# Altium schematic sheet MX8M-Nano-Boot.SchDoc
size 431 x 330 mm; SheetNumber: 6; SheetTotal: 16
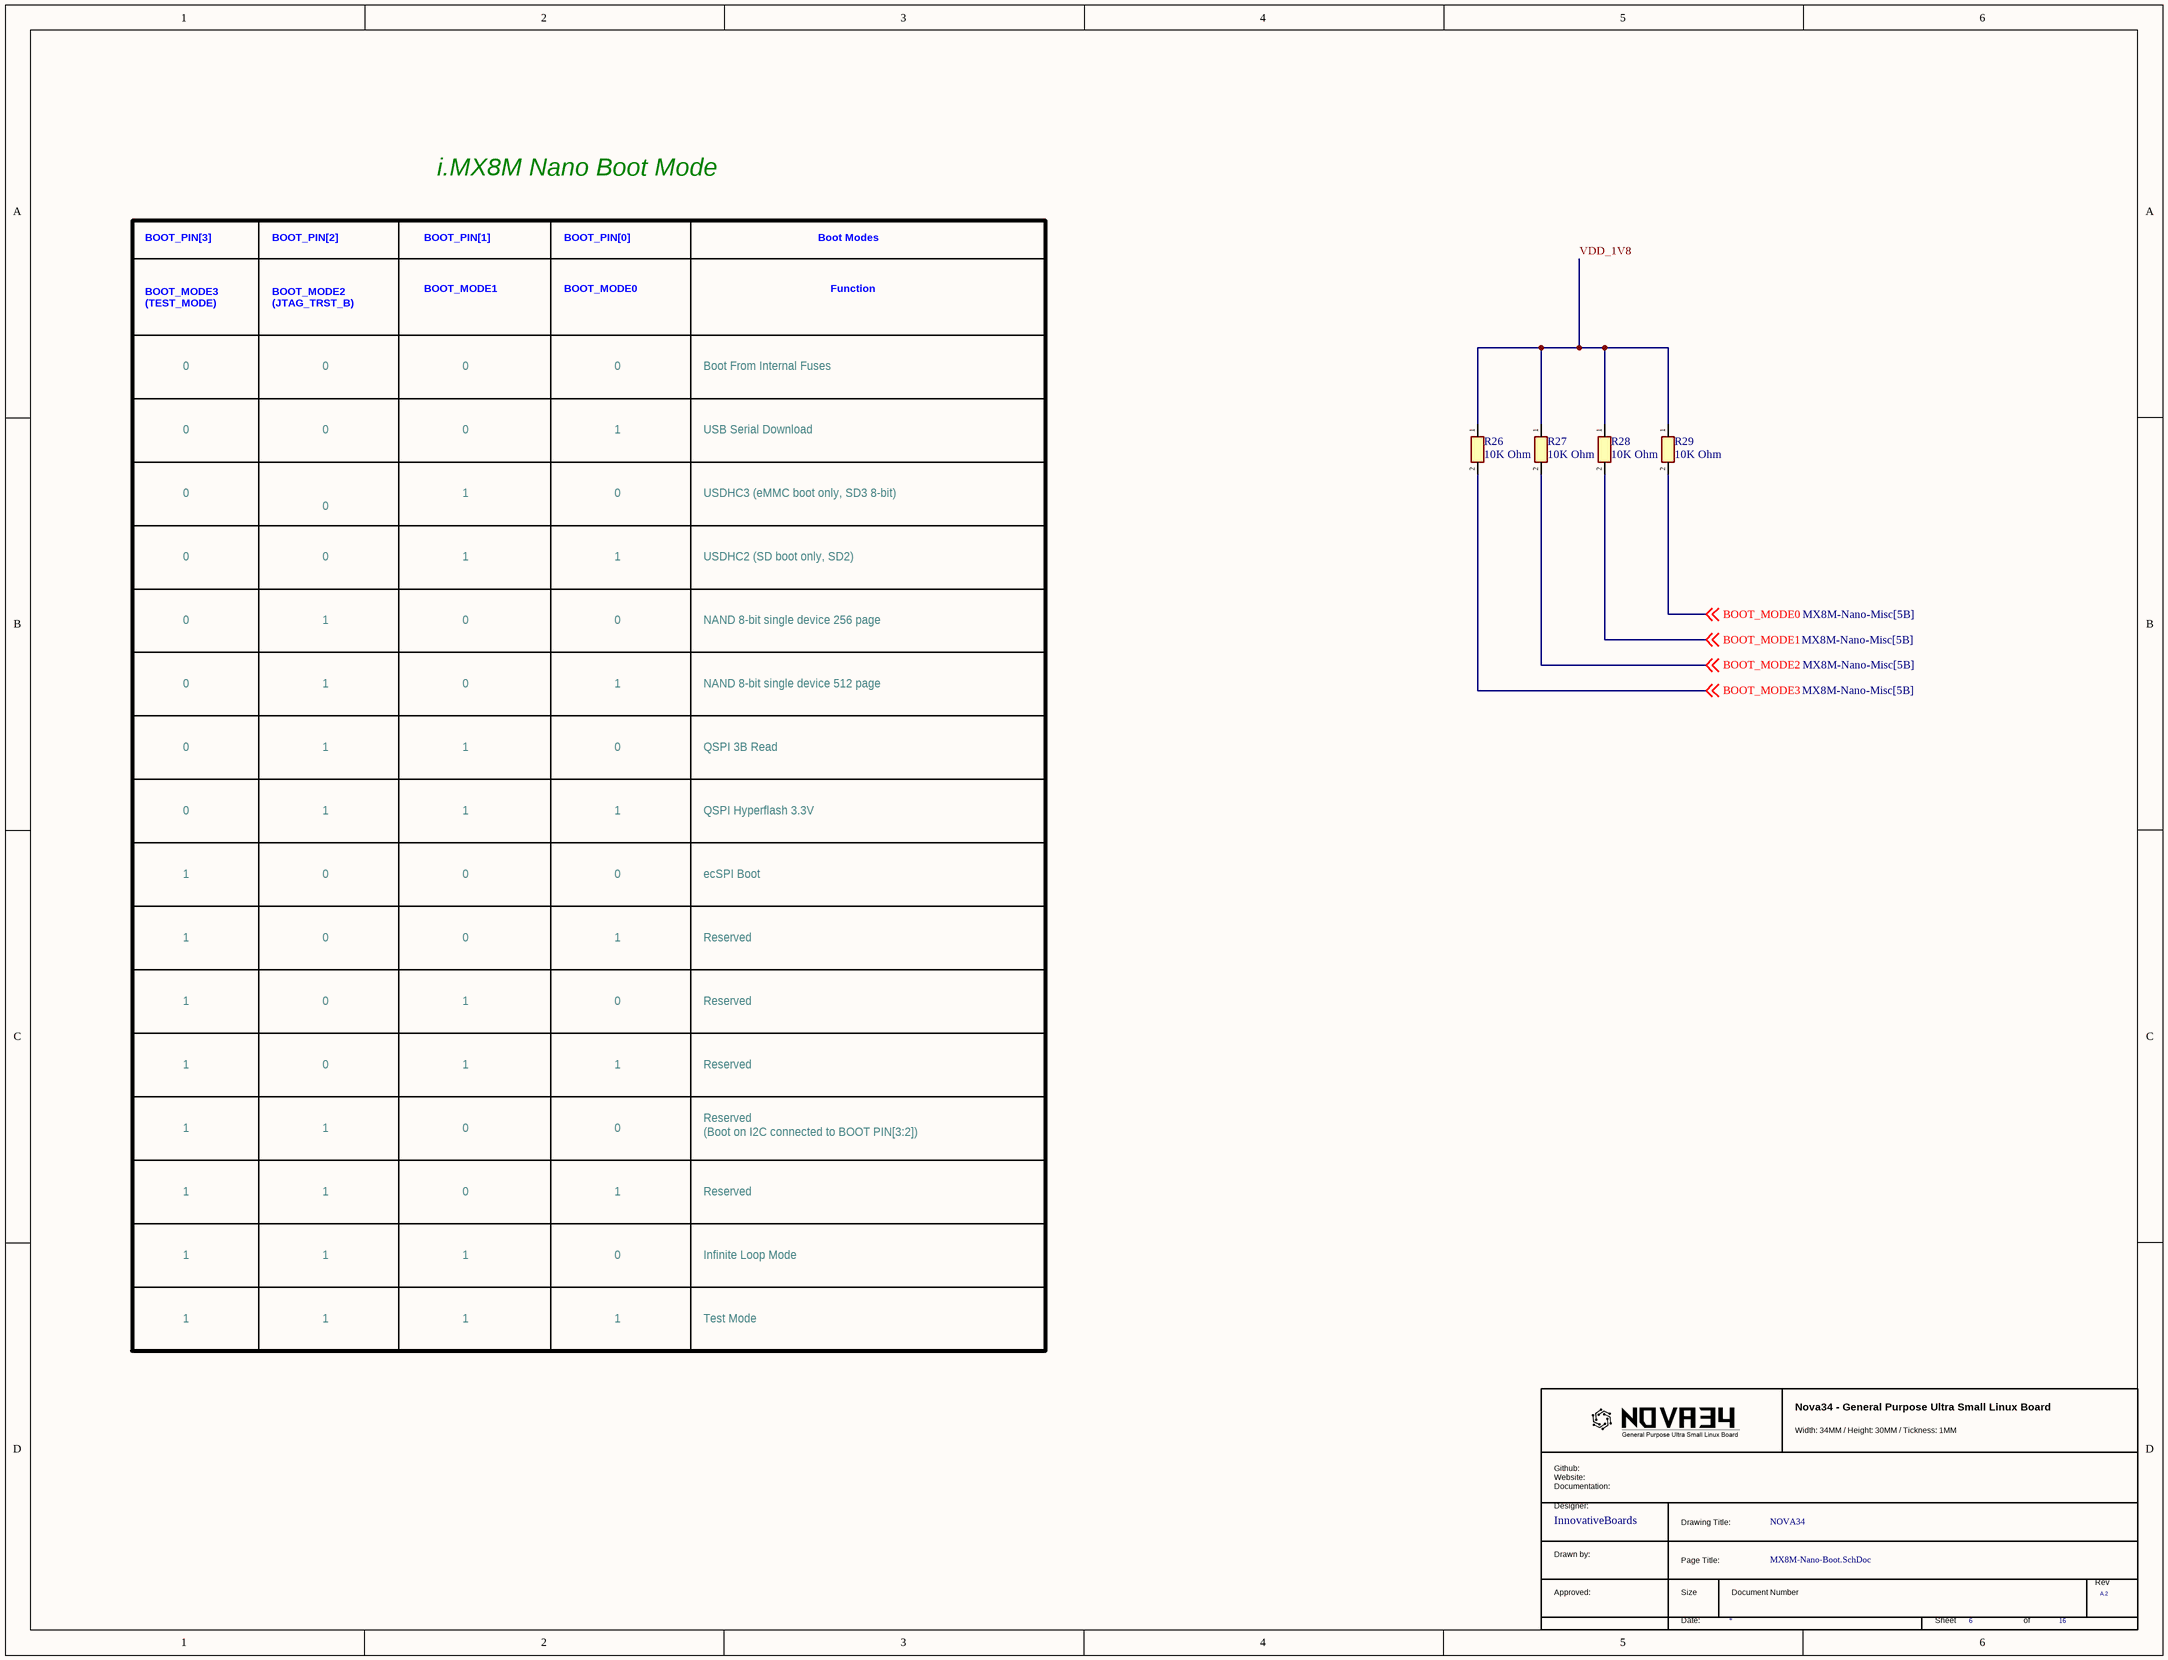
[diagram p0: MX8M-Nano-Boot.SchDoc]

## Parts
*  RevCode: A.2  (hidden comment: TitleBlock_MCPG)  (graphical)
R26  10K Ohm  [RESC1005X40N]
R27  10K Ohm  [RESC1005X40N]
R28  10K Ohm  [RESC1005X40N]
R29  10K Ohm  [RESC1005X40N]

## Nets
BOOT_MODE0: R29.2 ; off-sheet BOOT_MODE0
BOOT_MODE1: R28.2 ; off-sheet BOOT_MODE1
BOOT_MODE2: R27.2 ; off-sheet BOOT_MODE2
BOOT_MODE3: R26.2 ; off-sheet BOOT_MODE3
VDD_1V8: R26.1 R27.1 R28.1 R29.1

## Notes on the sheet
- i.MX8M Nano Boot Mode
- BOOT_PIN[3]
- BOOT_PIN[2]
- BOOT_PIN[1]
- BOOT_PIN[0]
- Boot Modes
- BOOT_MODE3
  (TEST_MODE)
- BOOT_MODE2
  (JTAG_TRST_B)
- BOOT_MODE1
- BOOT_MODE0
- Function
- 0
- Boot From Internal Fuses
- 1
- USB Serial Download
- USDHC3 (eMMC boot only, SD3 8-bit)
- USDHC2 (SD boot only, SD2)
- NAND 8-bit single device 256 page
- NAND 8-bit single device 512 page
- QSPI 3B Read
- QSPI Hyperflash 3.3V
- ecSPI Boot
- Reserved
- Reserved
  (Boot on I2C connected to BOOT PIN[3:2])
- Infinite Loop Mode
- Test Mode
- (in symbol TitleBlock_MCPG) Nova34 - General Purpose Ultra Small Linux Board; Width: 34MM / Height: 30MM / Tickness: 1MM; Github: / Website: / Documentation:; Designer:; InnovativeBoards; Drawing Title:; NOVA34; Drawn by:; Page Title:; Rev; Approved:; Size; Document Number; Date:; Sheet; of

## Library data of the parts
R26-R29 = RC0402FR-0710KL: Resistor; Manufacturer_Name: KEMET; Datasheet Link: http://www.yageo.com/documents/recent/PYu-RC0402_51_RoHS_L_6_r.pdf; Height: 0.4mm; Manufacturer_Part_Number: RC0402FR-0710KL; Mouser Part Number: 603-RC0402FR-0710KL; Mouser Price/Stock: https://www.mouser.co.uk/ProductDetail/YAGEO/RC0402FR-0710KL?qs=I1mnnYJTTsxUoNwrUsQExA%3D%3D; Arrow Part Number: RC0402FR-0710KL; Arrow Price/Stock: https://www.arrow.com/en/products/rc0402fr-0710kl/yageo?region=europe
* = TitleBlock_MCPG: Page Create Date: March  8, 1995